# Altium schematic sheet DRA818V_transceiver_module.SchDoc: DRA818V HAM transceiver
size A4; Date: 4/5/2016; DrawnBy: Salil Tembe; Engineer: Salil Tembe; DocumentNumber: 1; Revision: 1a; SheetNumber: 1; SheetTotal: 1; Reference: https://nebula.wsimg.com/bb20397fc7ffa1e43a58e57264597687?AccessKeyId=DAA432FA80C5DABC0234&disposition=0&alloworigin=1; DocumentName: DRA818V HAM transceiver
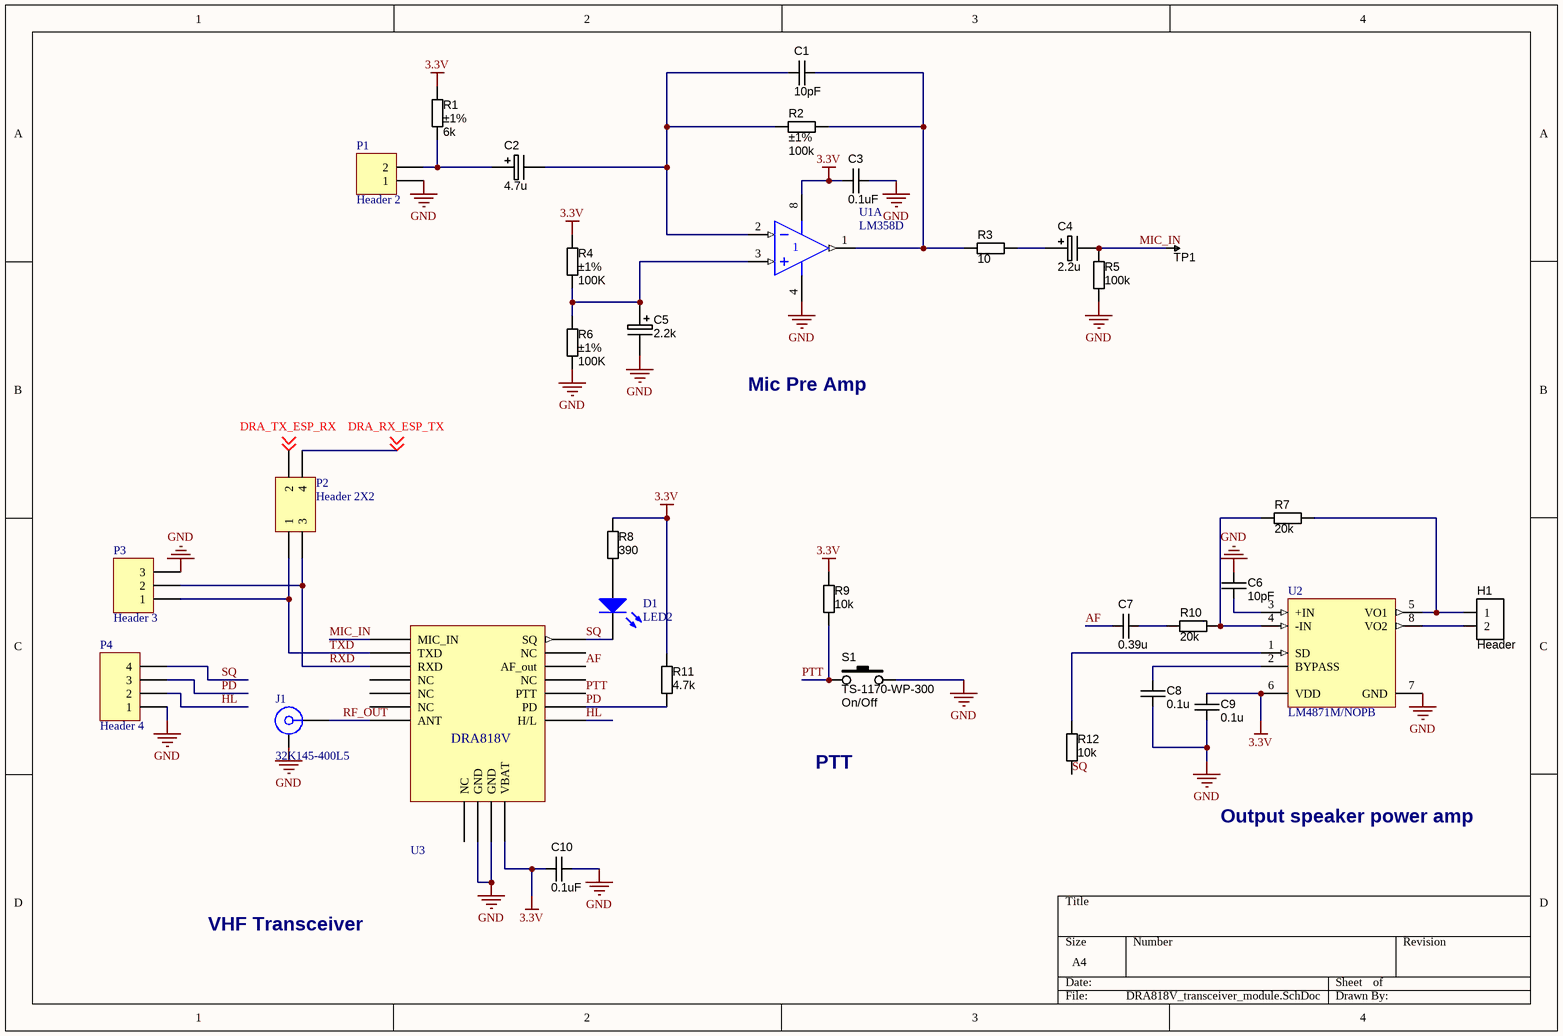
[diagram p0: DRA818V_transceiver_module.SchDoc]

## Parts
C1  value 10pF  [CAPC2012X135N]  (hidden comment: approved sub OK)
C2  4.7u  [CAPMP3216X180N]
C3  value 0.1uF  [CAPC2012X135N]  (hidden comment: approved sub OK)
C4  2.2u  [CAPMP3216X180N]
C5  2.2k  [CAPMP3216X180N]
C6  value 10pF  [CAPC2012X135N]  (hidden comment: approved sub OK)
C7  value 0.39u  [CAPC2012X135N]  (hidden comment: approved sub OK)
C8  value 0.1u  [CAPC2012X135N]  (hidden comment: approved sub OK)
C9  value 0.1u  [CAPC2012X135N]  (hidden comment: approved sub OK)
C10  value 0.1uF  [CAPC2012X135N]  (hidden comment: approved sub OK)
D1  LED2  [3.2X1.6X1.1]
H1  Header  [HDR_1x2_Offset]  (no BOM)
J1  32K145-400L5  [ROS-32K145-400L5_V]
P1  Header 2  [HDR1X2]
P2  Header 2X2  [HDR2X2]
P3  Header 3  [HDR1X3]
P4  Header 4  [HDR1X4]
R1  value 6k  Tolerance: ±1%  [ERA-0805]  (hidden comment: Thick Film)
R2  value 100k  Tolerance: ±1%  [ERA-0805]  (hidden comment: Thick Film)
R3  value 10  [ERA-0805]  (hidden comment: Jumper)
R4  value 100K  Tolerance: ±1%  [ERA-0805]  (hidden comment: Thick Film)
R5  value 100k  [6-0805]  (hidden comment: Jumper)
R6  value 100K  Tolerance: ±1%  [ERA-0805]  (hidden comment: Thick Film)
R7  value 20k  [ERA-0805]  (hidden comment: Jumper)
R8  value 390  [ERA-0805]  (hidden comment: Jumper)
R9  value 10k  [ERA-0805]  (hidden comment: Jumper)
R10  value 20k  [ERA-0805]  (hidden comment: Jumper)
R11  value 4.7k  [ERA-0805]  (hidden comment: Jumper)
R12  value 10k  [ERA-0805]  (hidden comment: Jumper)
S1  Manufacturer Part Number 1: TS-1170-WP-300  Function: On/Off  [TACT-SWITCH-TS1170]  (hidden comment: SW_THT_PB_7.0mm)
TP1  TESTPOINT  [TP-R60]  (value not drawn)  (no BOM)
U1  LM358D  [751-02_N]  (part A of 2)
U2  LM4871M/NOPB  [M08A_N]
U3  DRA818V  [DRA818_breakout]  (value not drawn)

## Nets
3.3V: C3.1 C9.2 C10.1 R1.1 R4.1 R8.2 R9.1 R11.1 U1.8(V+) U2.6(VDD) U3.8(VBAT)
GND: C3.2 C5.2 C6.2 C8.1 C9.1 C10.2 J1.MP P1.1 P3.3 P4.1 R5.2 R6.2 S1.2 U1.4(V-) U2.7(GND) U3.9(GND) U3.10(GND)
AF: C7.1 U3.3(AF_out)
DRA_RX_ESP_TX: P2.4 ; off-sheet DRA_RX_ESP_TX
DRA_TX_ESP_RX: P2.2 ; off-sheet DRA_TX_ESP_RX
HL: P4.2 U3.7(H/L)
MIC_IN: C4.2 R5.1 TP1.1 U3.18(MIC_IN)
PD: P4.3 R11.2 U3.6(PD)
PTT: R9.2 S1.1 U3.5(PTT)
RF_OUT: J1.1 U3.12(ANT)
RXD: P2.3 P3.2 U3.16(RXD)
SQ: D1.2(K) P4.4 R12.2 U3.1(SQ)
TXD: P2.1 P3.1 U3.17(TXD)
NetC1_1: C1.1 C2.2 R2.1 U1.2(IN-)
NetC1_2: C1.2 R2.2 R3.1 U1.1(OUT)
NetC2_1: C2.1 P1.2 R1.2
NetC4_1: C4.1 R3.2
NetC5_1: C5.1 R4.2 R6.1 U1.3(IN+)
NetC6_1: C6.1 U2.3(+IN)
NetC7_2: C7.2 R10.1
NetC8_2: C8.2 U2.2(BYPASS)
NetD1_1: D1.1(A) R8.1
NetH1_1: H1.1 R7.2 U2.5(VO1)
NetH1_2: H1.2 U2.8(VO2)
NetR7_1: R7.1 R10.2 U2.4(-IN)
NetR12_1: R12.1 U2.1(SD)

Not connected (* = marked no-connect by the designer): U3 2(NC) 4(NC) 11(NC) 13(NC) 14(NC) 15(NC)

## Notes on the sheet
- Mic Pre Amp
- PTT
- Output speaker power amp
- VHF Transceiver

## Library data of the parts
C1 C3 C6-C10 = CAPC_100n_0805_X7R_100V_10%: Capacitor SMD Cer 100nF 10% 100V X7R 0805; Manufacturer 1: TDK Corporation; Manufacturer Part Number 1: C2012X7R2A104K; Ratings: 100V; X7R; Material: ceramic; SCDType: undef; Package / Case: 0805; Tolerance: ±10%; Supplier 1: Digi-Key; Supplier Part Number 1: 445-1418-1-ND
C2 C4 C5 = CAPT_33u_3216_6V3: Capacitor SMD Tantalum 33uF 10% 6.3V 3216-18; Manufacturer 1: Kemet; Manufacturer Part Number 1: T491A336K006AT; Material: Solid Tantalum; SCDType: source; Package / Case: EIA 535BAAC size A; Ratings: 6.3V; Tolerance: ±10%; ComponentLink2URL: http://www.avx.com/docs/Catalogs/tcj.pdf; ComponentLink2Description: http://www.avx.com/docs/Catalogs/tcj.pdf; Supplier 1: Digi-Key; Supplier Part Number 1: 399-9716-1-ND; ComponentLink1URL: http://capacitoredge.kemet.com/capedge2/DataSheet?pn=T491A336K006AT; ComponentLink1Description: http://capacitoredge.kemet.com/capedge2/DataSheet?pn=T491A336K006AT; Supplier 2: Digi-Key; Supplier Part Number 2: 478-1666-1-ND; Manufacturer 2: AVX Corporation; Manufacturer Part Number 2: TAJA336K006RNJ; Manufacturer 4: Samsung Electro-Mechanics; Manufacturer Part Number 4: TCSCS0J336KAAR; ComponentLink4URL: http://components.arrow.com/partservice/dataview/altium/51540102S9917798N4139?apiKey=aa438727d59eed98c4bed826d8d949c84cb5e685b92bf87346a0226bd2658797; ComponentLink4Description: http://components.arrow.com/partservice/dataview/altium/51540102S9917798N4139?apiKey=aa438727d59eed98c4bed826d8d949c84cb5e685b92bf87346a0226bd2658797; Supplier 3: Digi-Key; Supplier Part Number 3: 293D336X96R3A2TE3-ND; Manufacturer Part Number 3: 293D336X96R3A2TE3; Manufacturer 3: Vishay Sprague; ComponentLink3URL: http://www.vishay.com/doc?40002; ComponentLink3Description: http://www.vishay.com/doc?40002; Supplier 4: Arrow; Supplier Part Number 4: 51540102S9917798N4139
  C2: Value: 4.7u
  C4: Value: 2.2u
  C5: Value: 2.2k
D1 = LED2: Typical RED, GREEN, YELLOW, AMBER GaAs LED; Published: 8-Jun-2000; LatestRevisionDate: 17-Jul-2002; LatestRevisionNote: Re-released for DXP Platform.; PackageVersion: Feb-2002; PackageReference: 3.2X1.6X1.1; Publisher: Altium Limited; PackageDescription: SM LED; 2 Flat Leads
H1 = Header2P: Header, 2-pin
J1 = 32K145-400L5: SMA Right Angle Jack, Edge Mount, Up to 18 GHz, -55 to 155 degC; Design Note 1: Footprint in library is a generic example - only application specific footprint delivers High Performance; Desgin Note 2: For more information about DRC setting, please look at following webpage, http://techdocs.altium.com/display/SCRT/Design+Rule+for+Edge-Mount+Connectors; DatasheetVersion: b00; PackageVersion: b00; PackageReference: 32K145-400L5; PackageDescription: SMA Right Angle Jack, Edge Mount, 14.25 x 9.5 x 4.46 mm; Mounting Technology: Surface Mount; PartNumber: 32K145-400L5; ComponentLink1Description: Manufacturer URL; ComponentLink1URL: http://www.rosenberger.de; ComponentLink2Description: Datasheet; ComponentLink2URL: http://rosenberger.de/ok/images/documents/db/32K145-400L5.pdf; ComponentLink3Description: Package Specification; ComponentLink3URL: http://rosenberger.de/ok/images/documents/db/32K145-400L5.pdf; ComponentLink4Description: Series Overview / Design Note; ComponentLink4URL: http://rosenberger.de/ok/images/documents/spez/32.pdf; ComponentLink5Description: Webshop / RFQ; ComponentLink5URL: http://www.rosenberger.com/en/contact/sales/
P1 = Header 2: Header, 2-Pin; LatestRevisionDate: 17-Jul-2002; LatestRevisionNote: Re-released for DXP Platform.; Publisher: Altium Limited
P2 = Header 2X2: Header, 2-Pin, Dual row; LatestRevisionDate: 17-Jul-2002; LatestRevisionNote: Re-released for DXP Platform.; Publisher: Altium Limited
P3 = Header 3: Header, 3-Pin; LatestRevisionDate: 17-Jul-2002; LatestRevisionNote: Re-released for DXP Platform.; Publisher: Altium Limited
P4 = Header 4: Header, 4-Pin; LatestRevisionDate: 17-Jul-2002; LatestRevisionNote: Re-released for DXP Platform.; Publisher: Altium Limited
R1 = RES_1K3_0805_1%: Resistor SMD chip 1.3k Ohm 0.125W 1% 0805; Manufacturer 1: Vishay/Dale; Manufacturer Part Number 1: CRCW08051K30FKEA; Ratings: 1/8W; SCDType: spec; Package / Case: 0805 (2012 metric); Supplier 1: Digi-Key; Supplier Part Number 1: 541-1.30KCCT-ND
R2 = RES_7K87_0805_1%: Resistor SMD chip 7.87k Ohm 0.125W 1% 0805; Manufacturer 1: Vishay/Dale; Manufacturer Part Number 1: CRCW08057K87FKEA; Ratings: 1/8W; SCDType: spec; Package / Case: 0805 (2012 metric); Supplier 1: Digi-Key; Supplier Part Number 1: 541-7.87KCCT-ND
R3 R5 R7-R12 = RES_0R_0805: Resistor SMD chip 0.0 Ohm 0.125W 0805; Manufacturer 1: Samsung Electro-Mechanics America, Inc; Manufacturer Part Number 1: RC2012J000CS; Ratings: 1/8W; SCDType: spec; Tolerance: N/A; Package / Case: 0805 (2012 metric); Supplier 1: Digi-Key; Supplier Part Number 1: 1276-5466-6-ND; RoHS 1: RoHS Compliant; ComponentLink1URL: http://www.samsungsem.com/servlet/FileDownload?filename=productcatalog/pdf/Chip_Resistor.pdf; ComponentLink1Description: http://www.samsungsem.com/servlet/FileDownload?filename=productcatalog/pdf/Chip_Resistor.pdf; Supplier 2: Digi-Key; Supplier Part Number 2: RMCF0805ZT0R00DKR-ND; Manufacturer 2: Stackpole Electronics Inc; Manufacturer Part Number 2: RMCF0805ZT0R00; RoHS 2: RoHS Compliant; ComponentLink2URL: http://www.seielect.com/Catalog/SEI-RMCF_RMCP.pdf; ComponentLink2Description: http://www.seielect.com/Catalog/SEI-RMCF_RMCP.pdf; Supplier 3: Digi-Key; Supplier Part Number 3: 311-0.0ARDKR-ND; Manufacturer 3: Yageo; Manufacturer Part Number 3: RC0805JR-070RL; RoHS 3: RoHS Compliant; ComponentLink3URL: http://media.digikey.com/pdf/Data%20Sheets/Yageo%20PDFs/RC0805%20Pb%20Free.pdf; ComponentLink3Description: http://media.digikey.com/pdf/Data%20Sheets/Yageo%20PDFs/RC0805%20Pb%20Free.pdf; Supplier 4: Digi-Key; Supplier Part Number 4: P0.0ADKR-ND; Manufacturer 4: Panasonic Electronic Components; Manufacturer Part Number 4: ERJ-6GEY0R00V; RoHS 4: RoHS Compliant; ComponentLink4URL: http://industrial.panasonic.com/www-cgi/jvcr13pz.cgi?E+PZ+3+AOA0001+ERJ6GEY0R00V+7+WW; ComponentLink4Description: http://industrial.panasonic.com/www-cgi/jvcr13pz.cgi?E+PZ+3+AOA0001+ERJ6GEY0R00V+7+WW; Supplier 5: Digi-Key; Supplier Part Number 5: RHM0.0CPDKR-ND; Manufacturer 5: Rohm Semiconductor; Manufacturer Part Number 5: MCR10ERTJ000; RoHS 5: RoHS Compliant; ComponentLink5URL: http://rohmfs.rohm.com/en/products/databook/datasheet/passive/resistor/chip_resistor/mcr_g.pdf; ComponentLink5Description: http://rohmfs.rohm.com/en/products/databook/datasheet/passive/resistor/chip_resistor/mcr_g.pdf
R4 R6 = RES_100K_0805_1%: Resistor SMD chip 100k Ohm 0.125W 1% 0805; Manufacturer 1: Vishay/Dale; Manufacturer Part Number 1: CRCW0805100KFKEA; Ratings: 1/8W; SCDType: spec; Package / Case: 0805 (2012 metric); Supplier 1: Digi-Key; Supplier Part Number 1: 541-100KCCT-ND
S1 = SW_THT_PB_7.0mm: Switch, tact, 7.0mm stem; Manufacturer 1: Bond-Tact; SCDType: source*; Package / Case: 6.5x6.5mm; 7.0mm stem; Material: Brass/Nylon/Ag plating
TP1 = TESTPOINT: SMD test pin
U1 = LM358D: Dual Low-Power Operational Amplifier; Published: 17-Jul-2002; LatestRevisionDate: 13-Apr-2006; LatestRevisionNote: IPC-7351 Footprint Added.; DatasheetVersion: 1988; PackageReference: 751-02; Publisher: Altium Limited; PackageDescription: 8-Pin Small Outline Integrated Circuit 1.27 mm Pitch; Code_JEDEC: MS-012-AA; Code_IPC: SOIC127P600-8; ComponentLink1Description: Manufacturer Link; ComponentLink1URL: http://www.onsemi.com/site/products/parametrics/0,4446,251,00.html; ComponentLink2Description: Datasheet; ComponentLink2URL: http://www.onsemi.com/pub/Collateral/LM358-D.PDF
U2 = LM4871M/NOPB: 3W Audio Power Amplifier with Shutdown Mode, 8-pin Narrow SOIC, Pb-Free; Manufacturer: National Semiconductor; PackageTopMarking: NSZXTT*4871; PowerWise: N; CompType: Audio IC; Published: 1-Mar-2010; DatasheetVersion: Jan-2003; PackageVersion: revM, May-2009; PackageReference: M08A; Publisher: Altium Limited; PackageDescription: SOIC Narrow, 4.9 x 3.9 x 1.45mm, 8 Lead, 1.27mm Pitch; Supplier 1: Digi-Key; Supplier Part Number 1: LM4871M-ND; Supplier 2: Farnell; Supplier Part Number 2: 1468873; PartNumber: LM4871M/NOPB; RoHS: Y; PinCount: 8; Code_JEDEC: MS-012-AA; Code_IPC: SOIC127P600-8; ComponentLink1Description: LM4871 Datasheet; ComponentLink1URL: http://www.national.com/ds/LM/LM4871.pdf; ComponentLink2Description: LM4871 Web Page; ComponentLink2URL: http://www.national.com/pf/LM/LM4871.html; ComponentLink3Description: M08A Package Page; ComponentLink3URL: http://www.national.com/packaging/folders/m08a.html